# EAGLE design Shema (EAGLE 7.6.0)
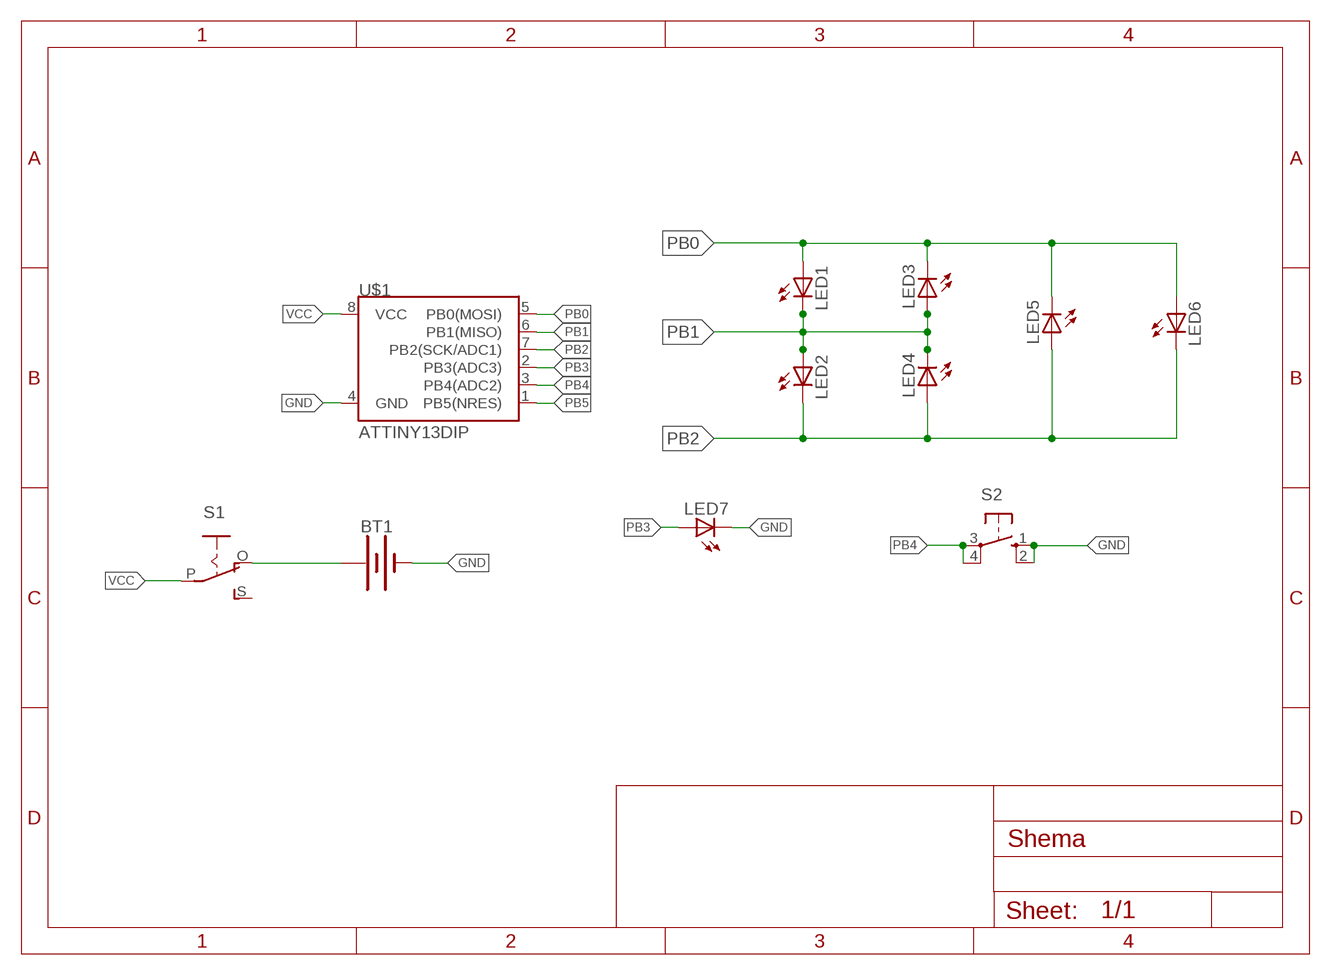
[diagram p0: schematic, sheet 1]

## Parts
BT1  BATTERY-20MM_PTH  [BATTCOM_20MM_PTH]
LED1  LED5MM  [LED5MM]
LED2  LED5MM  [LED5MM]
LED3  LED5MM  [LED5MM]
LED4  LED5MM  [LED5MM]
LED5  LED5MM  [LED5MM]
LED6  LED5MM  [LED5MM]
LED7  LED5MM  [LED5MM]
S1  EG1218S  [EG1218]
S2  40-XX  [B3F-40XX]
U$1  ATTINY13DIP  [DIP08_MCU]

## Nets
GND: BT1.2(-) LED7.K(C) S2.1(S) S2.2(S1) U$1.4(GND)
N$1: BT1.1(+) S1.O
PB0: LED1.A LED3.K(C) LED5.K(C) LED6.A U$1.5(PB0(MOSI))
PB1: LED1.K(C) LED2.A LED3.A LED4.K(C) U$1.6(PB1(MISO))
PB2: LED2.K(C) LED4.A LED5.A LED6.K(C) U$1.7(PB2(SCK/ADC1))
PB3: LED7.A U$1.2(PB3(ADC3))
PB4: S2.3(P) S2.4(P1) U$1.3(PB4(ADC2))
PB5: U$1.1(PB5(NRES))
VCC: S1.P U$1.8(VCC)
Unconnected: S1.S

## Library data of the parts
BT1 = SparkFun-Batteries:BATTERY: Battery - Single Cell A variety of battery chemistries, sizes, and footprints. Device List: 20MM_PTH - Coin Cell Battery Holder - 20mm (PTH) <https://www.sparkfun.com/products/783> 6.8MM_PTH - Coin Cell Battery Holder - 6.8MM(SMD) <https://www.digikey.com/product-detail/en/seiko-instruments/MS621FE-FL11E/728-1057-ND/1889208?WT.srch=1&gclid=CNOQ5a6LzdQCFZS2wAodXCkE0g> 12MM_SMD - Coin Cell Battery Holder - 12mm (SMD) <https://www.sparkfun.com/products/10592> 12MM_PTH - Coin Cell Battery Holder - 12mm (PTH) <https://www.sparkfun.com/products/7948> 20MM_SMD - 20mm Coin Cell Battery Holder (SMD) (2 legs) Used on the Big Time Watch Kit <https://www.sparkfun.com/products/11734> 20MM_SMD_4LEGS - Coin Cell Battery Holder - 20mm (SMD) <https://www.sparkfun.com/products/11892> 20MM_SMD_4LEGS_OVERPASTE - Coin Cell Battery Holder - 20mm (SMD) <https://www.sparkfun.com/products/11892> (Over-paste on the legs) 24.5MM_PTH - Coin Cell Battery Holder - 24.5mm (PTH) <https://www.sparkfun.com/products/8863> 9V - 9V Battery Holder - PC Mount Used on the SparkFun SparkPunk Sound Kit <https://www.sparkfun.com/products/11177> and SparkFun SparkPunk Sequencer Kit <https://www.sparkfun.com/products/12707> 18650 - Battery Holder - 18650 (PTH) <https://www.sparkfun.com/products/13113> AA - Battery Holder - 1xAA (PTH) <https://www.sparkfun.com/products/7949> AAA - Battery Holder - 1xAAA (PTH) <https://www.sparkfun.com/products/12718> AA_KIT - Battery Holder - 1xAA (PTH) <https://www.sparkfun.com/products/7949> Special kit package - pads only have exposed copper on one side of the board. AAA_KIT - Battery Holder - 1xAAA (PTH) <https://www.sparkfun.com/products/12718> Special kit package - pads only have exposed copper on one side of the board.; PROD_ID: BATT-09031; SF_SKU: PRT-00783
LED1-LED7 = adafruit:LED: LED OSRAM: - CHIPLED LG R971, LG N971, LY N971, LG Q971, LY Q971, LO R971, LY R971 LH N974, LH R974 LS Q976, LO Q976, LY Q976 LO Q996 - Hyper CHIPLED LW Q18S LB Q993, LB Q99A, LB R99A - SideLED LS A670, LO A670, LY A670, LG A670, LP A670 LB A673, LV A673, LT A673, LW A673 LH A674 LY A675 LS A676, LA A676, LO A676, LY A676, LW A676 LS A679, LY A679, LG A679 - Hyper Micro SIDELED® LS Y876, LA Y876, LO Y876, LY Y876 LT Y87S - SmartLED LW L88C, LW L88S LB L89C, LB L89S, LG L890 LS L89K, LO L89K, LY L89K LS L896, LA L896, LO L896, LY L896 - TOPLED LS T670, LO T670, LY T670, LG T670, LP T670 LSG T670, LSP T670, LSY T670, LOP T670, LYG T670 LG T671, LOG T671, LSG T671 LB T673, LV T673, LT T673, LW T673 LH T674 LS T676, LA T676, LO T676, LY T676, LB T676, LH T676, LSB T676, LW T676 LB T67C, LV T67C, LT T67C, LS T67K, LO T67K, LY T67K, LW E67C LS E67B, LA E67B, LO E67B, LY E67B, LB E67C, LV E67C, LT E67C LW T67C LS T679, LY T679, LG T679 LS T770, LO T770, LY T770, LG T770, LP T770 LB T773, LV T773, LT T773, LW T773 LH T774 LS E675, LA E675, LY E675, LS T675 LS T776, LA T776, LO T776, LY T776, LB T776 LHGB T686 LT T68C, LB T68C - Hyper Mini TOPLED® LB M676 - Mini TOPLED Santana® LG M470 LS M47K, LO M47K, LY M47K Source: http://www.osram.convergy.de/
S1 = adafruit:EG1218: SLIDING SWITCH 0.1" spacing through hole, vertical SPDT slide switch http://www.ladyada.net/library/pcb/eaglelibrary.html
S2 = adafruit:40-XX: OMRON SWITCH; MF: OMRON COMPONENTS USA; MPN: B3F-4000; OC_FARNELL: 176434; OC_NEWARK: 36K3105
U$1 = SparkFun-Retired:ATTINY13: ATTINY13 Retired

## Board
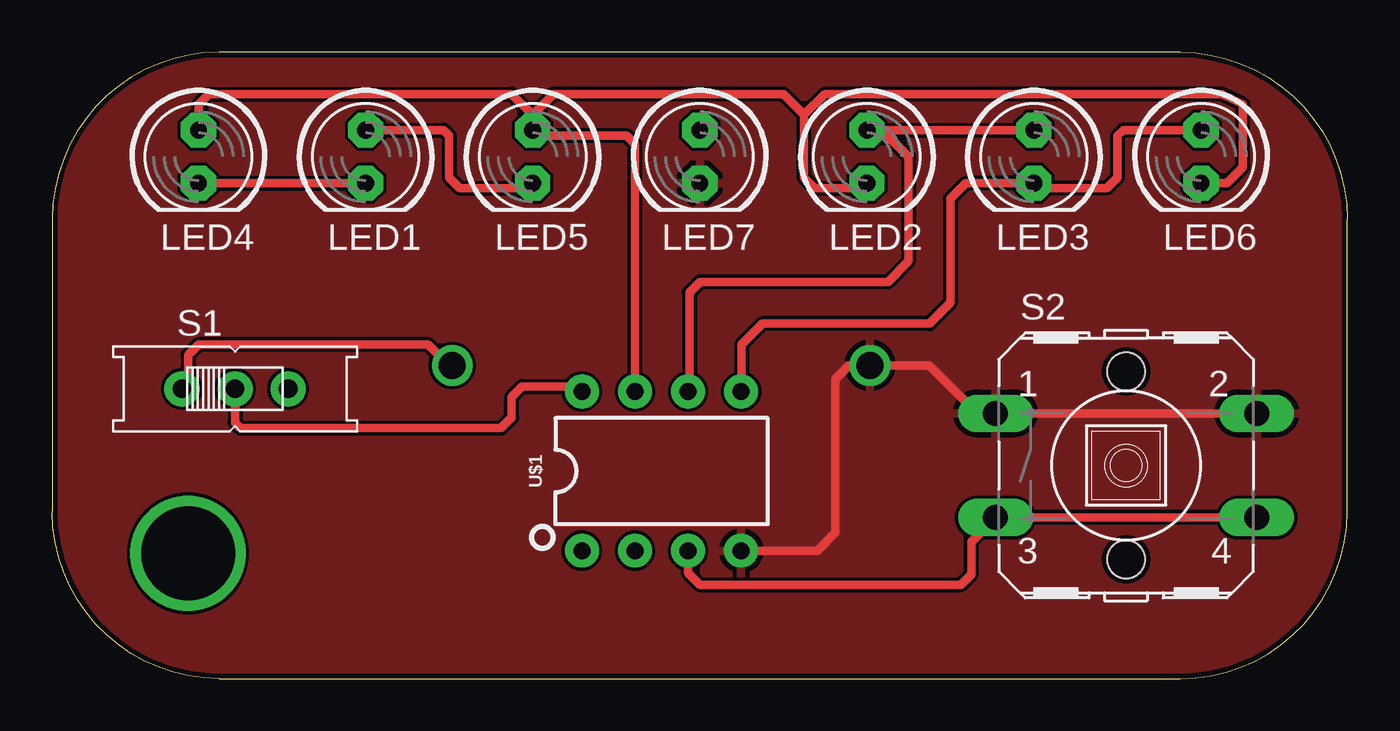
[diagram p1: board, top side]
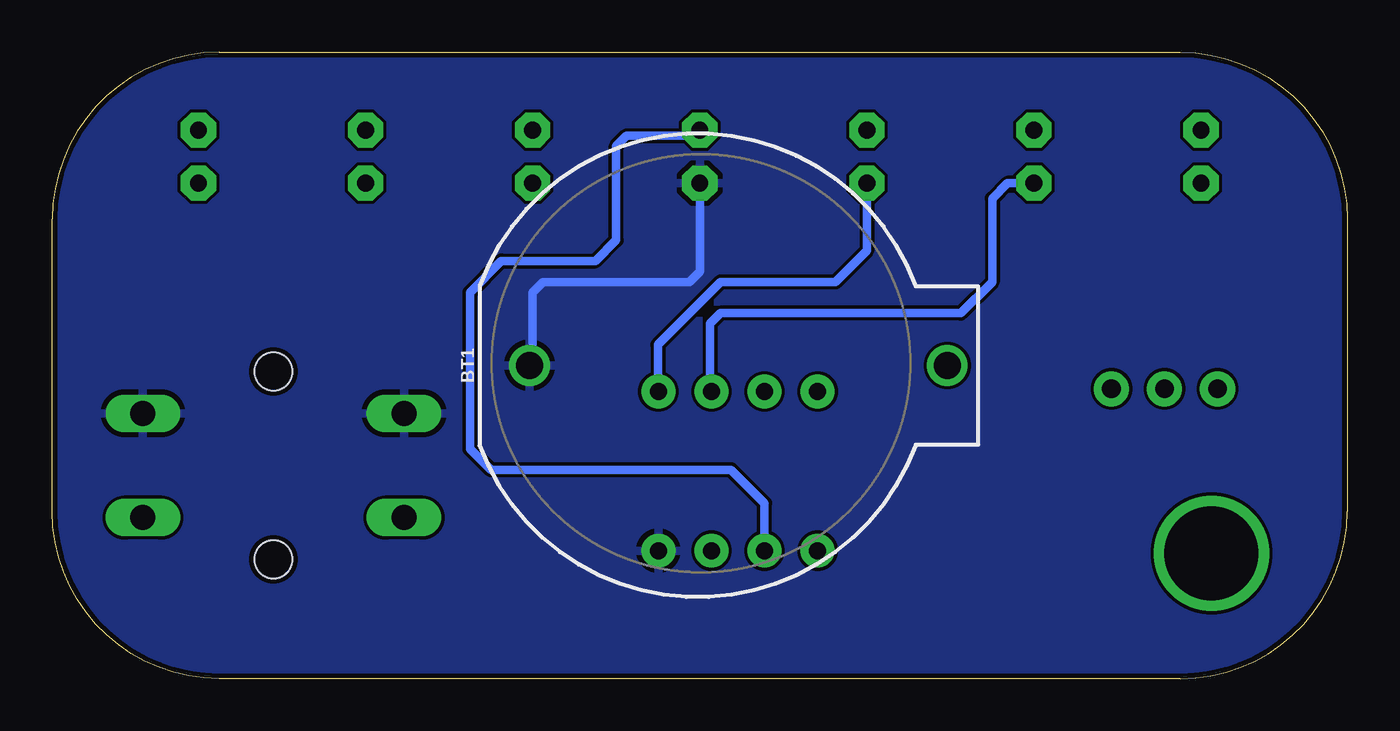
[diagram p2: board, bottom side, seen from below]

Size 62 x 30 mm. Coordinates in mm from the lower left corner, seen from the top.
Outline: 8,0 54,0 arc90 62,8 62,22 arc90 54,30 8,30 arc90 0,22 0,8 arc90 8,0
Copper layers (1*16): Top 0.035mm / dielectric 1.5mm / Bottom 0.035mm
Design rules "SeeedStudio_2layer_DRU_no_angle_20140221": minimum track width 6mil, minimum drill 12mil, track to track 6mil, track to pad 6mil, pad to pad 6mil, via to via 6mil, smd to smd 0mil, copper to edge 10mil, drill to drill 10mil, minimum pad ring 10mil, minimum via ring 6mil, stop-mask expansion 2mil, vias tented up to drill 100mil, thermal gap 10mil

### Footprints (pad centres in the part's own frame; a part is rotated, then mirrored left to right if it is on the bottom)
BATTCOM_20MM_PTH = drill 1.3: 1 11.85,0; 2 -8.15,0
LED5MM = drill 0.813 pad 1.676 octagon: A -1.27,0; K 1.27,0
EG1218 = drill 0.9 pad 1.676: O -2.54,0; P 0,0; S 2.54,0
B3F-40XX = drill 1.194 long: 1 -6.248,2.489; 2 6.248,2.489; 3 -6.248,-2.489; 4 6.248,-2.489 | hole 1.803: 0,-4.496; 0,4.496
DIP08_MCU = drill 0.813 pad 1.626: 1 -3.81,-3.81; 2 -1.27,-3.81; 3 1.27,-3.81; 4 3.81,-3.81; 5 3.81,3.81; 6 1.27,3.81; 7 -1.27,3.81; 8 -3.81,3.81

### Placement (x,y rotation side)
BT1  31,15 0 bottom
LED1  15,25 270 top
LED2  39,25 270 top
LED3  47,25 270 top
LED4  7,25 270 top
LED5  23,25 270 top
LED6  55,25 270 top
LED7  31,25 270 top
S1  8.75,13.88 0 top
S2  51.41,10.21 0 top
U$1  29.17,9.94 0 top

### Tracks (layer width: path | path; a pad name or v marks a point on that pad's centre or on a via)
GND
  Top 0.406: S2.2 S2.1 44.3,12.7 42,15 BT1.2 38.15,15 37.5,14.35 37.5,7 36.63,6.13 U$1.4
  Bottom 0.406: LED7.K 31,19.5 31.5,19 38.5,19 39,18.5 39,15.15 BT1.2
  pour Bottom: 0,30 62,30 62,0 0,0
  pour Top: 0,30 62,30 62,0 0,0
N$1
  Top 0.406: BT1.1 19,15 18,16 7,16 6.5,15.5 6.5,14.17 S1.O
N$2  (via drill 4.5)
  other vias: 6.5,6
PB0
  Top 0.406: LED6.A 51.27,26.27 51,26 51,24 50.5,23.5 47.23,23.5 LED3.K 43.73,23.73 43,23 43,18 42,17 34,17 33,16 33,13.77 U$1.5 | LED1.A 18.73,26.27 19,26 19,24 19.5,23.5 22.77,23.5 LED5.K
  Bottom 0.406: LED5.K 23,20.5 24.5,19 30,19 33,16 33,13.77 U$1.5
PB1
  Top 0.406: LED4.K LED1.K | LED3.A LED2.A 39.73,26.27 41,25 41,20 40,19 31,19 30.5,18.5 30.5,13.81 U$1.6
  Bottom 0.406: LED1.K 16.27,23.73 17,23 17,19 18.5,17.5 30,17.5 30.5,17 30.5,13.81 U$1.6
PB2
  Top 0.406: LED4.A 7,27.5 7.5,28 22,28 23,27 | 23,27 LED5.A 23.27,26 27.5,26 27.9,25.6 U$1.7 | LED6.K 56.23,23.73 57,24.5 57,27.5 56,28 37,28 36,27 | LED2.K 38.77,23.5 36.5,23.5 36,24 36,27 | 36,27 35,28 24,28 23,27
PB3
  Bottom 0.406: U$1.2 27.9,8.4 29.5,10 41,10 42,11 42,18.5 40.5,20 36,20 35,21 35,25.5 34.5,26 31.27,26 LED7.A
PB4
  Top 0.406: S2.4 S2.3 44,6.56 44,5 43.5,4.5 31,4.5 30.44,5.06 U$1.3
VCC
  Top 0.406: S1.P 8.75,12.25 9,12 21.5,12 22,12.5 22,13.5 22.5,14 25.11,14 U$1.8

### Text on the board
200bmp: + | + | + | + | + | + | + | LED1 | LED2 | LED3 | LED4 | LED5 | LED6 | LED7 | S2 | ON | OFF | S1 | IC | . | DIY "STOP ME" GAME
208bmp: BAT